# EAGLE design MotorDriver2016 (EAGLE 6.2)
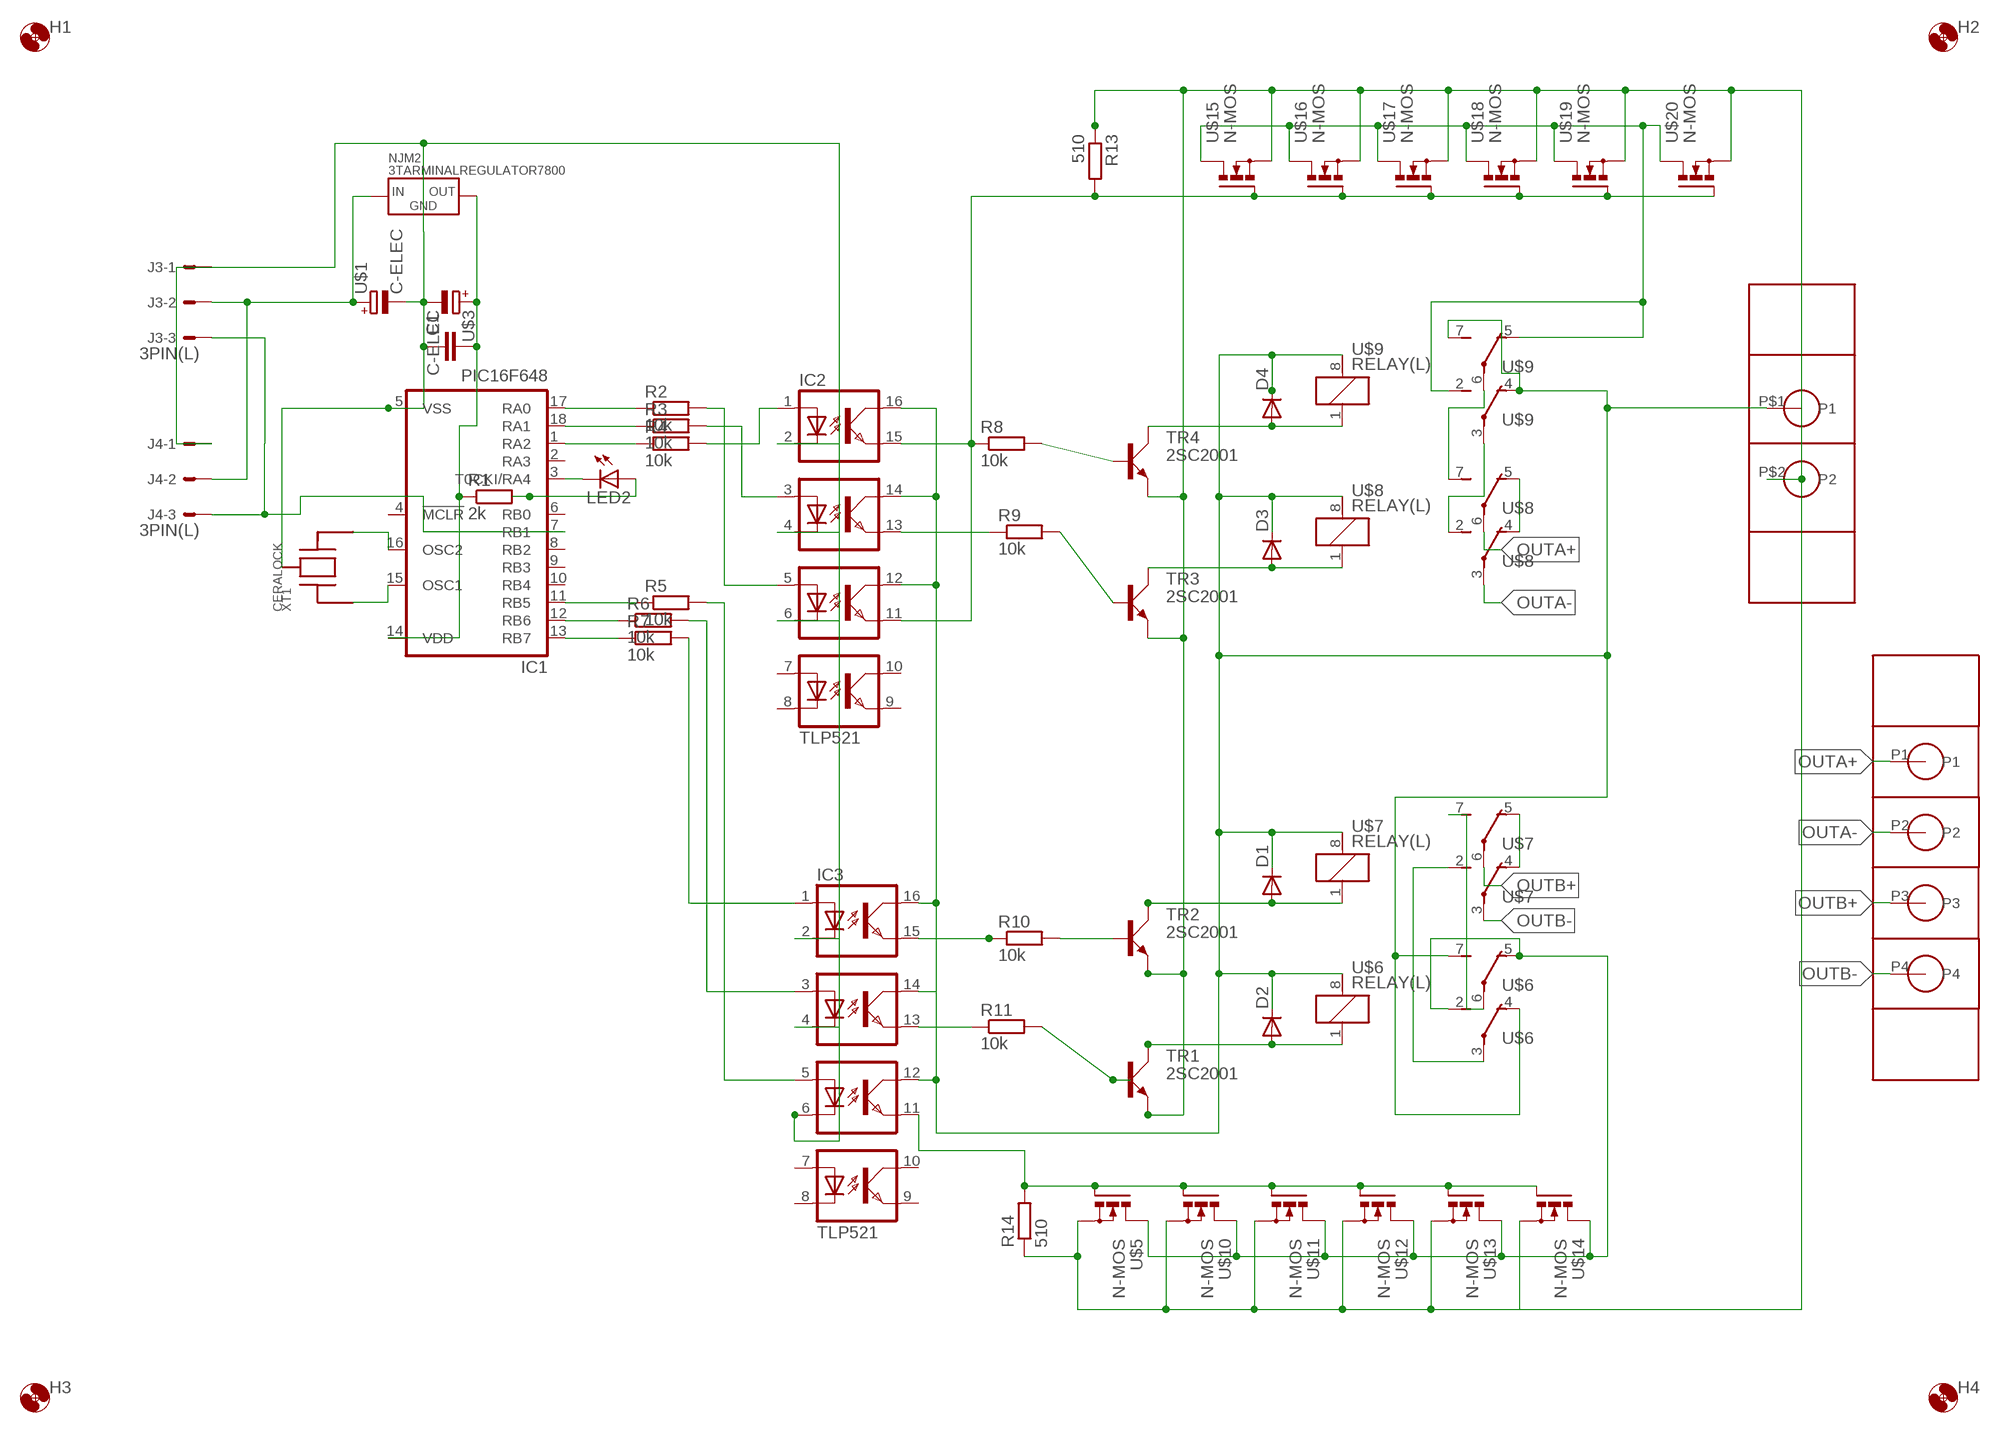
[diagram p0: schematic, sheet 1]

## Parts
C1  C-  [C-2.54]
D1  DIODE7.5  [DIODE7.5]
D2  DIODE7.5  [DIODE7.5]
D3  DIODE7.5  [DIODE7.5]
D4  DIODE7.5  [DIODE7.5]
H1  HOLE3.3M3BOLT  [HOLE3.3]
H2  HOLE3.3M3BOLT  [HOLE3.3]
H3  HOLE3.3M3BOLT  [HOLE3.3]
H4  HOLE3.3M3BOLT  [HOLE3.3]
IC1  PIC16F648  [DIL18]
IC2  TLP521  [DIL16]
IC3  TLP521  [DIL16]
J3  3PIN(L)  [3PL]
J4  3PIN(L)  [3PL]
LED2  LED5MM  [LED5MM]
NJM2  3TARMINALREGULATOR7800  [TO-220]
R1  2k  R-EU_R3216W  [R3216W]
R2  10k  R-EU_R3216W  [R3216W]
R3  10k  R-EU_R3216W  [R3216W]
R4  10k  R-EU_R3216W  [R3216W]
R5  10k  R-EU_R3216W  [R3216W]
R6  10k  R-EU_R3216W  [R3216W]
R7  10k  R-EU_R3216W  [R3216W]
R8  10k  R-EU_R3216W  [R3216W]
R9  10k  R-EU_R3216W  [R3216W]
R10  10k  R-EU_R3216W  [R3216W]
R11  10k  R-EU_R3216W  [R3216W]
R13  510  R-EU_R3216W  [R3216W]
R14  510  R-EU_R3216W  [R3216W]
TR1  2SC2001  [TO92BCE]
TR2  2SC2001  [TO92BCE]
TR3  2SC2001  [TO92BCE]
TR4  2SC2001  [TO92BCE]
U$1  C-ELEC  [C-6MM]
U$2  BP341L  [BP341L]
U$3  C-ELEC  [C-6MM]
U$4  BP341L_1  [BP341L]
U$5  N-MOS  [TO220BV]
U$6  RELAY(L)  [G2R2]
U$7  RELAY(L)  [G2R2]
U$8  RELAY(L)  [G2R2]
U$9  RELAY(L)  [G2R2]
U$10  N-MOS  [TO220BV]
U$11  N-MOS  [TO220BV]
U$12  N-MOS  [TO220BV]
U$13  N-MOS  [TO220BV]
U$14  N-MOS  [TO220BV]
U$15  N-MOS  [TO220BV]
U$16  N-MOS  [TO220BV]
U$17  N-MOS  [TO220BV]
U$18  N-MOS  [TO220BV]
U$19  N-MOS  [TO220BV]
U$20  N-MOS  [TO220BV]
XT1  CERALOCK  [CERALOCK]

## Nets
5V: C1.P$2 IC1.14(VDD) NJM2.OUT R1.1 U$3.+
9V: J3.2 J4.2 NJM2.IN U$1.+
12V: D1.PK(C) D2.PK(C) D3.PK(C) D4.PK(C) IC2.12(COL2) IC2.14(COL1) IC2.16(COL0) IC3.12(COL2) IC3.14(COL1) IC3.16(COL0) U$4.P$1(P1) U$6.4(R2:O) U$6.7(R1:S) U$6.8 U$7.8 U$8.8 U$9.4(R2:O) U$9.7(R1:S) U$9.8
FET_D1: U$9.2(R2:S) U$9.5(R1:O) U$15.D U$16.D U$17.D U$18.D U$19.D U$20.D
FET_G1: IC2.11(EMIT2) R13.2 U$15.G U$16.G U$17.G U$18.G U$19.G U$20.G
FET_G2: IC3.11(EMIT2) R14.2 U$5.G U$10.G U$11.G U$12.G U$13.G U$14.G
GND1: C1.P$1 IC1.5(VSS) IC2.2(C0) IC2.4(C1) IC2.6(C2) IC3.2(C0) IC3.4(C1) IC3.6(C2) J3.1 J4.1 NJM2.GND U$1.- U$3.- XT1.P2
GND2: R13.1 R14.1 TR1.E TR2.E TR3.E TR4.E U$4.P$2(P2) U$5.S U$10.S U$11.S U$12.S U$13.S U$14.S U$15.S U$16.S U$17.S U$18.S U$19.S U$20.S
LED_A: LED2.A R1.2
LED_C: IC1.3(T0CKI/RA4) LED2.K(C)
N$1: IC1.16(OSC2) XT1.P3
N$7: IC1.15(OSC1) XT1.P1
N$10: IC1.17(RA0) R2.1
N$11: IC1.18(RA1) R3.1
N$12: IC1.1(RA2) R4.1
N$13: IC1.13(RB7) R7.1
N$14: IC1.12(RB6) R6.1
N$15: IC1.11(RB5) R5.1
N$16: IC2.5(A2) R2.2
N$17: IC2.3(A1) R3.2
N$18: IC2.1(A0) R4.2
N$19: IC3.1(A0) R7.2
N$20: IC3.3(A1) R6.2
N$21: IC3.5(A2) R5.2
N$23: IC2.15(EMIT0) R8.1
N$24: IC2.13(EMIT1) R9.1
N$25: IC3.15(EMIT0) R10.1
N$26: IC3.13(EMIT1) R11.1
N$27: R11.2 TR1.B
N$29: D4.PA(A) TR4.C U$9.1
N$30: D3.PA(A) TR3.C U$8.1
N$31: D1.PA(A) TR2.C U$7.1
N$32: D2.PA(A) TR1.C U$6.1
N$37: U$5.D U$6.2(R2:S) U$6.5(R1:O) U$10.D U$11.D U$12.D U$13.D U$14.D
N$40: U$8.7(R1:S) U$9.6(R1:P)
N$41: U$8.2(R2:S) U$9.3(R2:P)
N$42: U$8.4(R2:O) U$8.5(R1:O)
N$43: R8.2 TR4.B
N$44: R9.2 TR3.B
N$45: R10.2 TR2.B
N$50: U$6.6(R1:P) U$7.7(R1:S)
N$51: U$6.3(R2:P) U$7.2(R2:S)
N$53: U$7.4(R2:O) U$7.5(R1:O)
OUTA+: U$2.P1 U$8.6(R1:P)
OUTA-: U$2.P2 U$8.3(R2:P)
OUTB+: U$2.P3 U$7.6(R1:P)
OUTB-: U$2.P4 U$7.3(R2:P)
SIGNAL: IC1.7(RB1) J3.3 J4.3
Unconnected: IC1.2(RA3) IC1.4(!MCLR) IC1.6(RB0) IC1.8(RB2) IC1.9(RB3) IC1.10(RB4) IC2.7(A3) IC2.8(C3) IC2.9(EMIT3) IC2.10(COL3) IC3.7(A3) IC3.8(C3) IC3.9(EMIT3) IC3.10(COL3)

## Library data of the parts
C1 = My_rcl:C-
D1-D4 = diode:DIODE7.5
H1-H4 = Hole:HOLE3.3
IC1 = FP-21T for MITS:PIC16F648
IC2 IC3 = FP-21T for MITS:TLP521
J3 J4 = my_connector:3PIN(L)
LED2 = FP-21T for MITS:LED: LED OSRAM: - CHIPLED LG R971, LG N971, LY N971, LG Q971, LY Q971, LO R971, LY R971 LH N974, LH R974 LS Q976, LO Q976, LY Q976 LO Q996 - Hyper CHIPLED LW Q18S LB Q993, LB Q99A, LB R99A - SideLED LS A670, LO A670, LY A670, LG A670, LP A670 LB A673, LV A673, LT A673, LW A673 LH A674 LY A675 LS A676, LA A676, LO A676, LY A676, LW A676 LS A679, LY A679, LG A679 - Hyper Micro SIDELED® LS Y876, LA Y876, LO Y876, LY Y876 LT Y87S - SmartLED LW L88C, LW L88S LB L89C, LB L89S, LG L890 LS L89K, LO L89K, LY L89K LS L896, LA L896, LO L896, LY L896 - TOPLED LS T670, LO T670, LY T670, LG T670, LP T670 LSG T670, LSP T670, LSY T670, LOP T670, LYG T670 LG T671, LOG T671, LSG T671 LB T673, LV T673, LT T673, LW T673 LH T674 LS T676, LA T676, LO T676, LY T676, LB T676, LH T676, LSB T676, LW T676 LB T67C, LV T67C, LT T67C, LS T67K, LO T67K, LY T67K, LW E67C LS E67B, LA E67B, LO E67B, LY E67B, LB E67C, LV E67C, LT E67C LW T67C LS T679, LY T679, LG T679 LS T770, LO T770, LY T770, LG T770, LP T770 LB T773, LV T773, LT T773, LW T773 LH T774 LS E675, LA E675, LY E675, LS T675 LS T776, LA T776, LO T776, LY T776, LB T776 LHGB T686 LT T68C, LB T68C - Hyper Mini TOPLED® LB M676 - Mini TOPLED Santana® LG M470 LS M47K, LO M47K, LY M47K Source: http://www.osram.convergy.de - LUMILED® LXK2-PW12-R00, LXK2-PW12-S00, LXK2-PW14-U00, LXK2-PW14-V00 LXK2-PM12-R00, LXK2-PM12-S00, LXK2-PM14-U00 LXK2-PE12-Q00, LXK2-PE12-R00, LXK2-PE12-S00, LXK2-PE14-T00, LXK2-PE14-U00 LXK2-PB12-K00, LXK2-PB12-L00, LXK2-PB12-M00, LXK2-PB14-N00, LXK2-PB14-P00, LXK2-PB14-Q00 LXK2-PR12-L00, LXK2-PR12-M00, LXK2-PR14-Q00, LXK2-PR14-R00 LXK2-PD12-Q00, LXK2-PD12-R00, LXK2-PD12-S00 LXK2-PH12-R00, LXK2-PH12-S00 LXK2-PL12-P00, LXK2-PL12-Q00, LXK2-PL12-R00 Source: www.luxeon.com
NJM2 = regulator:3TARMINALREGULATOR
R1-R11 R13 R14 = rcl:R-EU_: RESISTOR, European symbol
TR1-TR4 = My_transistor:2SC2001: NPN Transistor
U$1 U$3 = My_rcl:C-ELEC
U$2 = BP341_4PIN:BP341L
U$4 = BP341L_1:BP341L_1
U$5 U$10-U$20 = FET_kai:N-MOS
U$6-U$9 = relay:RELAY(L)
XT1 = ceralock:CERALOCK

## Board
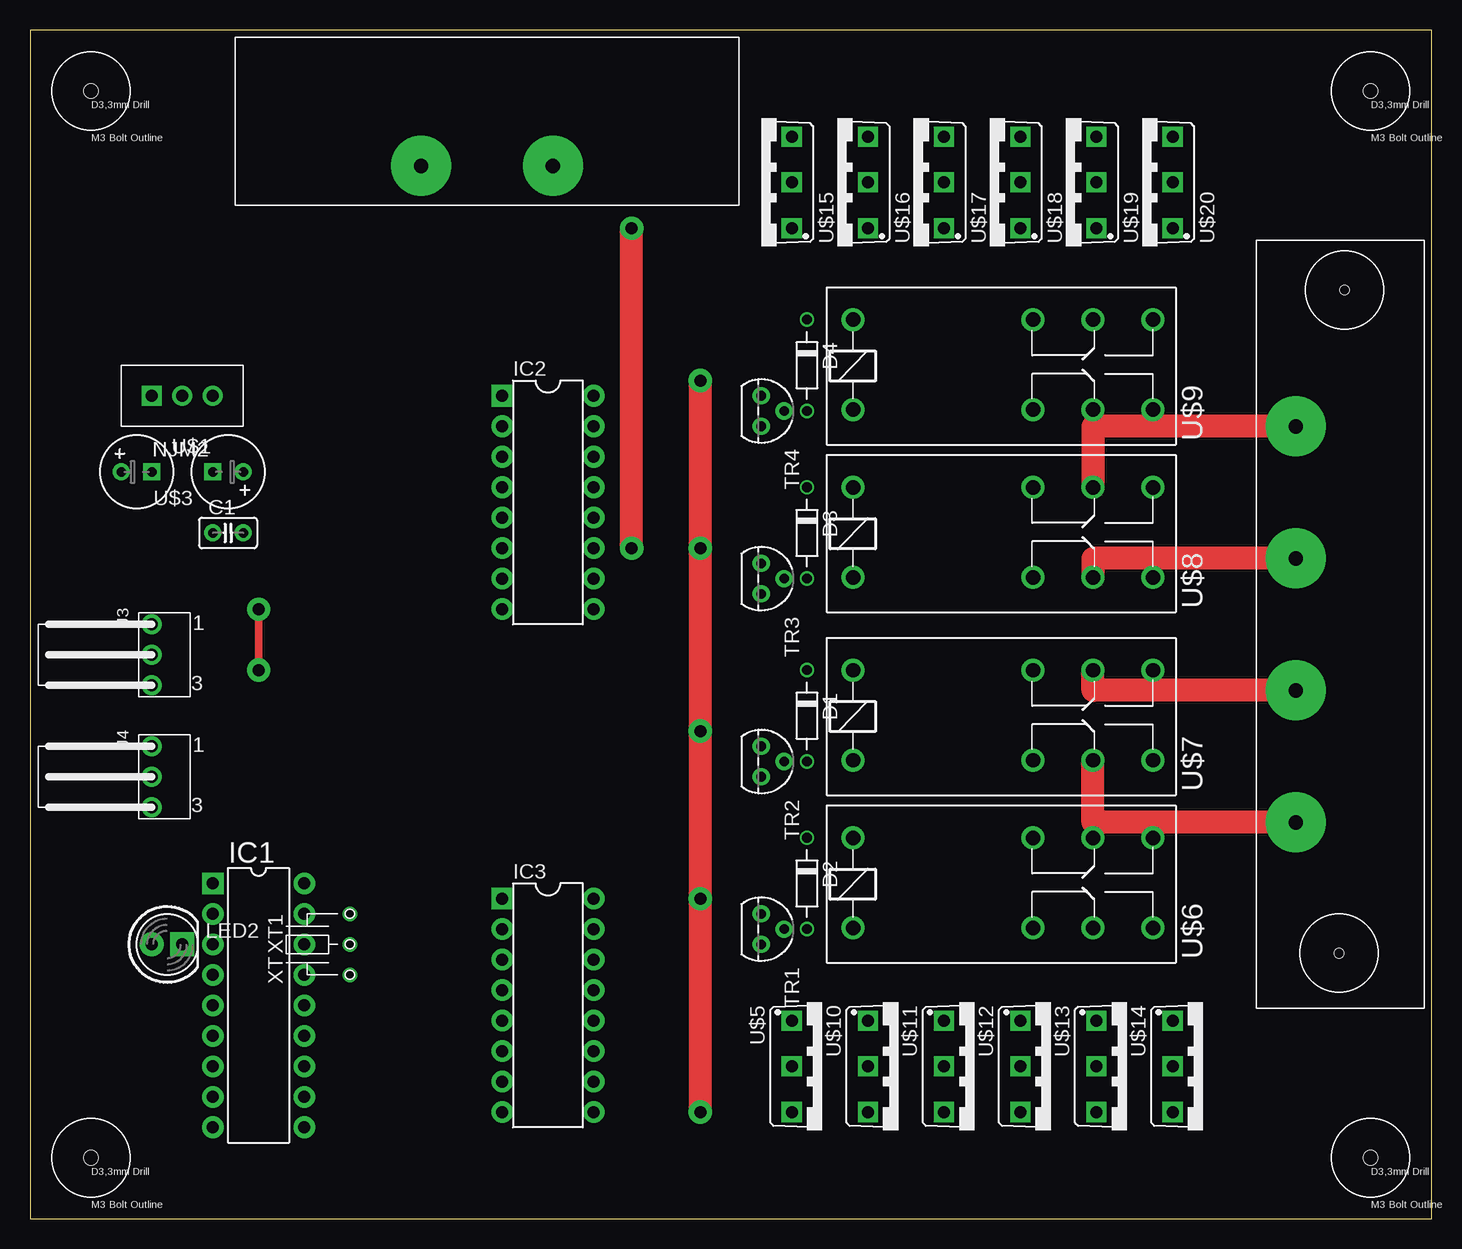
[diagram p1: board, top side]
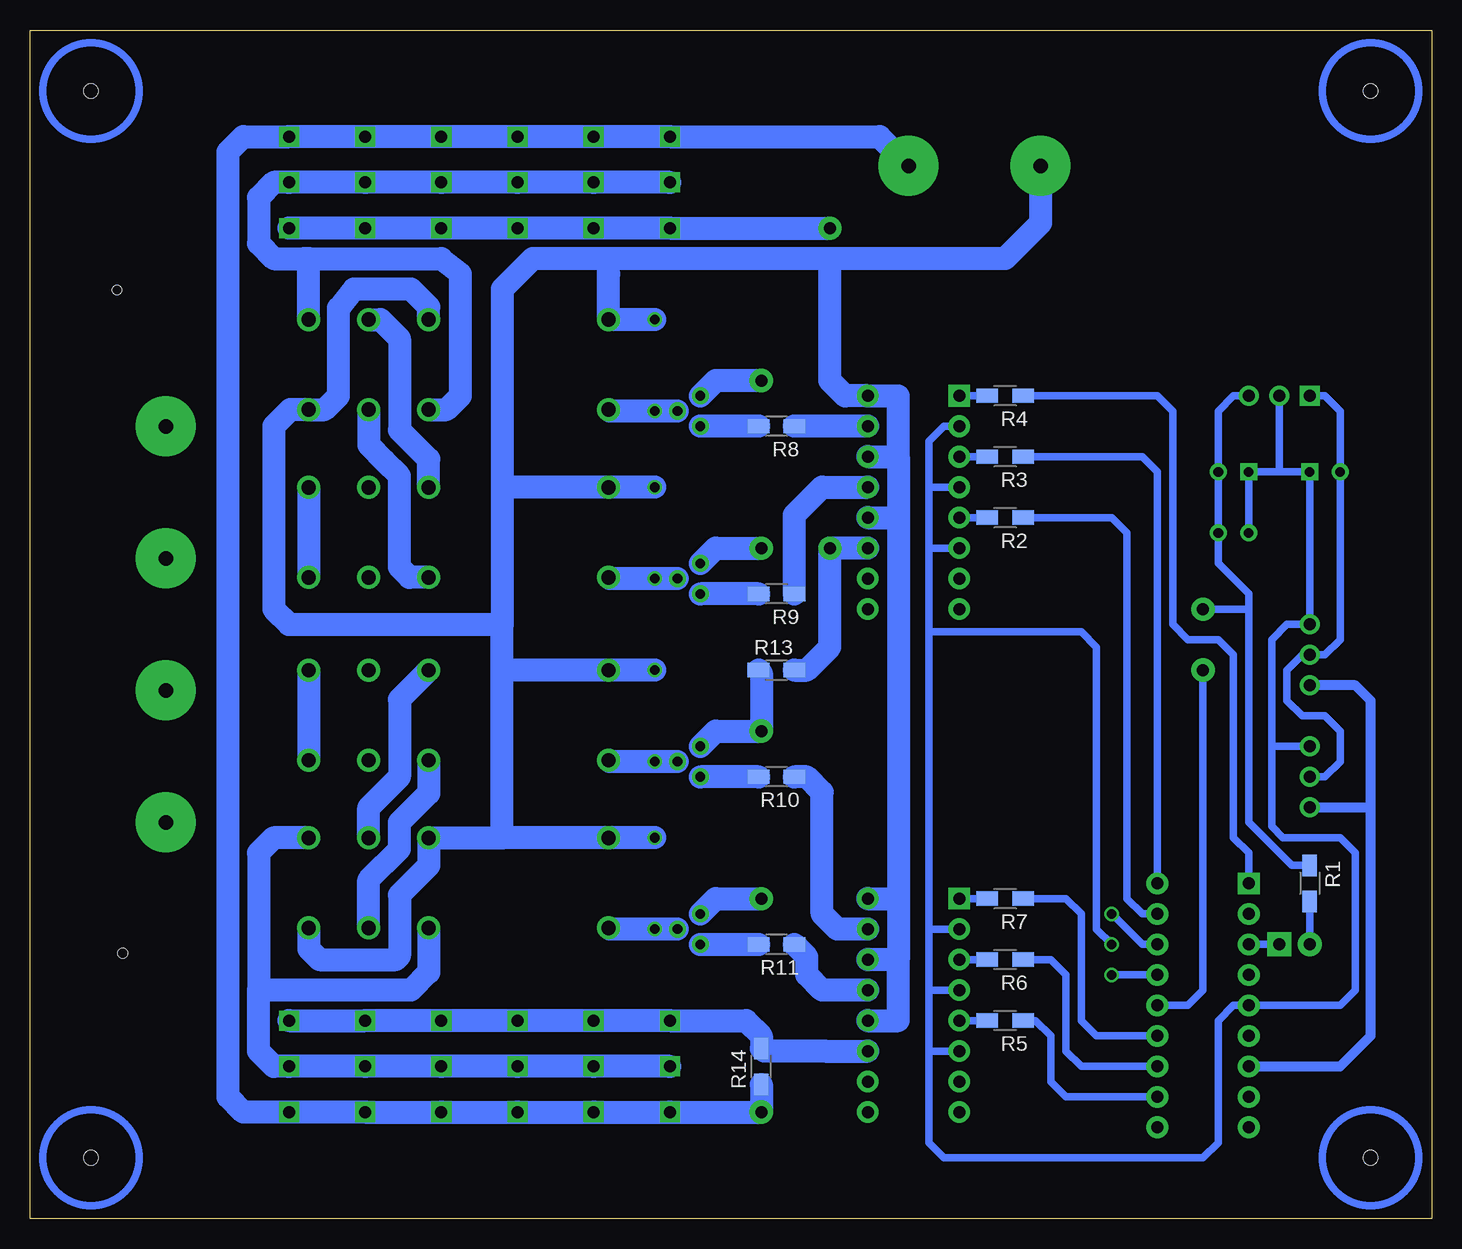
[diagram p2: board, bottom side, seen from below]

Size 116.84 x 99.06 mm. Coordinates in mm from the lower left corner, seen from the top.
Outline: 0,0 116.84,0 116.84,99.06 0,99.06 0,0
Copper layers (1*16): Top 0.035mm / dielectric 1.5mm / Bottom 0.035mm
Design rules: minimum track width 0.15mm, minimum drill 0.3mm, track to track 0.25mm, track to pad 0.25mm, pad to pad 0.25mm, via to via 0.25mm, smd to smd 0.2mm, copper to edge 100mil, drill to drill 0.45mm, minimum pad ring 0.15mm, minimum via ring 0.15mm, stop-mask expansion 4mil, vias tented up to drill 0mil, thermal gap 0.15mm

### Footprints (pad centres in the part's own frame; a part is rotated, then mirrored left to right if it is on the bottom)
C-2.54 = drill 0.8 pad 1.422: P$1 -1.27,0; P$2 1.27,0
DIODE7.5 = drill 0.8: PA 3.81,0; PK -3.81,0
HOLE3.3 = hole 1.2: 0,0
DIL18 = drill 1 pad 1.8 square: 1 -10.16,-3.81 | drill 1 pad 1.8: 2 -7.62,-3.81; 3 -5.08,-3.81; 4 -2.54,-3.81; 5 0,-3.81; 6 2.54,-3.81; 7 5.08,-3.81; 8 7.62,-3.81; 9 10.16,-3.81; 10 10.16,3.81; 11 7.62,3.81; 12 5.08,3.81; 13 2.54,3.81; 14 0,3.81; 15 -2.54,3.81; 16 -5.08,3.81; 17 -7.62,3.81; 18 -10.16,3.81
DIL16 = drill 1 pad 1.8 square: 1 -8.89,-3.81 | drill 1 pad 1.8: 2 -6.35,-3.81; 3 -3.81,-3.81; 4 -1.27,-3.81; 5 1.27,-3.81; 6 3.81,-3.81; 7 6.35,-3.81; 8 8.89,-3.81; 9 8.89,3.81; 10 6.35,3.81; 11 3.81,3.81; 12 1.27,3.81; 13 -1.27,3.81; 14 -3.81,3.81; 15 -6.35,3.81; 16 -8.89,3.81
3PL = drill 1 pad 1.676: 1 2.54,3.81; 2 0,3.81; 3 -2.54,3.81
LED5MM = drill 1 pad 2: A -1.27,0 | drill 1 pad 2 square: K 1.27,0
TO-220 = drill 1 pad 1.676: GND 0,0; OUT 2.54,0 | drill 1 pad 1.676 square: IN -2.54,0
R3216W = smd 1.8 x 1.2: 1 -1.499,0; 2 1.499,0
TO92BCE = drill 0.8 pad 1.422: B 1.27,0; C 0,1.905; E -1.27,0
C-6MM = drill 0.8 pad 1.422: + -1.27,0 | drill 0.8 pad 1.422 square: - 1.27,0
BP341L = drill 1.2 pad 5: P1 -16.5,-3.7; P2 -5.5,-3.7; P3 5.5,-3.7; P4 16.5,-3.7 | hole 0.8: -27.87,0.37; 27.4,-0.1
BP341L' = drill 1.2 pad 5: P$1 -5.499,-3.698; P$2 5.499,-3.698
TO220BV = drill 1 pad 1.676 square: D 0,0; G -3.81,0; S 3.81,0
G2R2 = drill 1.2 pad 1.93: 1 -11.4,-3.7; 2 3.6,-3.7; 3 8.6,-3.7; 4 13.6,-3.7; 5 13.6,3.8; 6 8.6,3.8; 7 3.6,3.8; 8 -11.4,3.8
CERALOCK = drill 0.8: P1 -2.54,-3.81; P2 0,-3.81; P3 2.54,-3.81

### Placement (x,y rotation side)
C1  16.51,57.15 0 top
D1  64.77,41.91 270 top
D2  64.77,27.94 270 top
D3  64.77,57.15 270 top
D4  64.77,71.12 270 top
H1  111.76,5.08 0 top
H2  5.08,93.98 0 top
H3  5.08,5.08 0 top
H4  111.76,93.98 0 top
IC1  19.05,17.78 270 top
IC2  43.18,59.69 270 top
IC3  43.18,17.78 270 top
J3  13.97,46.99 90 top
J4  13.97,36.83 90 top
LED2  11.43,22.86 0 top
NJM2  12.7,68.58 0 top
R1  10.16,27.94 270 bottom
R2  35.56,58.42 180 bottom
R3  35.56,63.5 180 bottom
R4  35.56,68.58 180 bottom
R5  35.56,16.51 180 bottom
R6  35.56,21.59 180 bottom
R7  35.56,26.67 180 bottom
R8  54.61,66.04 180 bottom
R9  54.61,52.07 180 bottom
R10  54.61,36.83 180 bottom
R11  54.61,22.86 180 bottom
R13  54.61,45.72 0 bottom
R14  55.88,12.7 90 bottom
TR1  60.96,24.13 270 top
TR2  60.96,38.1 270 top
TR3  60.96,53.34 270 top
TR4  60.96,67.31 270 top
U$1  8.89,62.23 0 top
U$2  109.22,49.53 270 top
U$3  16.51,62.23 180 top
U$4  BP341L_1  [BP341L']  38.1,91.44 0 top
U$5  63.5,12.7 270 top
U$6  80.01,27.94 0 top
U$7  80.01,41.91 0 top
U$8  80.01,57.15 0 top
U$9  80.01,71.12 0 top
U$10  69.85,12.7 270 top
U$11  76.2,12.7 270 top
U$12  82.55,12.7 270 top
U$13  88.9,12.7 270 top
U$14  95.25,12.7 270 top
U$15  63.5,86.36 90 top
U$16  69.85,86.36 90 top
U$17  76.2,86.36 90 top
U$18  82.55,86.36 90 top
U$19  88.9,86.36 90 top
U$20  95.25,86.36 90 top
XT1  22.86,22.86 90 top

### Tracks (layer width: path | path; a pad name or v marks a point on that pad's centre or on a via)
5V  (via drill 1 pad 1.93)
  Top 0.61: v19.05,45.72 v19.05,50.8
  Bottom 0.61: NJM2.OUT 16.51,68.58 17.78,67.31 U$3.+ C1.P$2 17.78,54.61 15.24,52.07 15.24,50.8 | R1.1 11.66,29.44 15.24,33.02 15.24,50.8 | IC1.14 20.32,17.78 19.05,19.05 v19.05,45.72 | v19.05,50.8 15.24,50.8
9V
  Bottom 0.61: J4.2 8.89,36.83 7.62,38.1 7.62,40.64 8.89,41.91 10.79,41.91 12.06,43.18 12.06,45.72 10.79,46.99 J3.2 8.89,46.99 7.62,48.26 U$1.+ 7.62,67.31 8.89,68.58 NJM2.IN
12V
  Bottom 1.93: U$9.7 83.61,75.99 85.09,77.47 89.85,77.47 91.12,75.88 91.12,68.58 92.28,67.42 U$9.4 95.14,67.42 96.52,66.04 96.52,50.8 95.25,49.53 77.47,49.53 | D2.PK U$6.8 77.47,31.74 | D1.PK U$7.8 | U$7.8 | D3.PK U$8.8 | U$8.8 | U$7.8 77.47,45.72 | 77.47,45.72 77.47,49.53 | U$8.8 77.47,60.95 | 77.47,60.95 77.47,49.53 | 77.47,60.95 77.47,74.92 77.47,77.47 74.93,80.01 68.58,80.01 | 77.47,31.74 77.47,45.72 | U$6.4 93.61,22.49 92.71,21.59 86.36,21.59 86.04,21.91 86.04,26.99 83.61,29.42 U$6.7 77.47,31.74 | IC3.16 44.45,26.67 | IC3.12 44.45,16.51 44.45,21.59 | 44.45,21.59 IC3.14 | 44.45,26.67 44.45,21.59 | 44.45,63.5 44.45,68.58 IC2.16 48.9,68.58 50.16,69.85 50.16,80.01 | IC2.12 44.45,58.42 | 44.45,58.42 44.45,26.67 | 44.45,63.5 44.45,58.42 | IC2.14 44.45,63.5 | U$4.P$1 32.6,82.97 35.56,80.01 50.16,80.01 | 50.16,80.01 68.58,80.01 | D4.PK U$9.8 68.61,78.71 68.58,80.01
FET_D1
  Bottom 1.93: U$15.D U$16.D U$17.D U$18.D U$19.D U$20.D 96.52,86.36 97.79,85.09 97.79,81.28 96.52,80.01 93.98,80.01 | 93.98,80.01 82.55,80.01 80.96,78.74 80.96,68.58 82.12,67.42 U$9.2 | U$9.5 93.61,80.01 93.98,80.01
FET_G1  (via drill 1 pad 1.93)
  Top 1.93: v50.16,55.88 v50.16,82.55
  Bottom 1.93: U$20.G U$19.G U$18.G U$17.G U$16.G U$15.G v50.16,82.55 | IC2.11 v50.16,55.88 50.16,47.62 52.07,45.72 R13.2
FET_G2
  Bottom 1.93: U$14.G U$13.G U$12.G U$11.G U$10.G U$5.G 57.15,16.51 55.88,15.24 R14.2 55.65,13.97 50.57,13.97 IC3.11
GND1
  Bottom 0.61: J4.1 12.06,39.37 13.34,39.37 | 12.7,62.23 U$1.- J3.1 12.06,49.53 13.34,48.26 13.34,40.64 13.34,39.37 | 12.7,62.23 U$3.- C1.P$1 | NJM2.GND 12.7,62.23 | 13.34,39.37 13.34,32.7 12.38,31.75 7.62,31.75 6.35,30.48 6.35,19.05 7.62,17.78 IC1.5 16.51,17.78 17.78,16.51 17.78,6.35 19.05,5.08 40.64,5.08 41.91,6.35 41.91,13.97 | IC2.2 40.64,66.04 41.91,64.77 41.91,60.96 | 41.91,60.96 41.91,55.88 | 41.91,55.88 41.91,48.9 | 41.91,48.9 41.91,24.13 | 41.91,24.13 41.91,19.05 | 41.91,19.05 41.91,13.97 | XT1.P2 27.94,24.13 27.94,47.62 29.21,48.9 41.91,48.9 | IC2.6 41.91,55.88 | IC2.4 41.91,60.96 | IC3.2 41.91,24.13 | IC3.4 41.91,19.05 | IC3.6 41.91,13.97
GND2  (via drill 1 pad 1.93)
  Top 1.93: v55.88,8.89 v55.88,26.67 v55.88,40.64 v55.88,55.88 v55.88,69.85
  Bottom 1.93: TR3.E 59.69,55.88 v55.88,55.88 | TR2.E 59.69,40.64 v55.88,40.64 55.88,45.49 R13.1 | TR1.E 59.69,26.67 v55.88,26.67 | R14.1 v55.88,8.89 U$5.S U$10.S U$11.S U$12.S U$13.S U$14.S 99.06,8.89 100.33,10.16 100.33,88.9 99.06,90.17 U$20.S U$19.S U$18.S U$17.S U$16.S U$15.S 46.03,90.17 U$4.P$2 | v55.88,69.85 59.69,69.85 TR4.E
LED_A
  Bottom 0.61: R1.2 LED2.A
LED_C
  Bottom 0.61: LED2.K IC1.3
N$1
  Bottom 0.61: IC1.16 24.13,22.86 XT1.P3
N$7
  Bottom 0.61: IC1.15 XT1.P1
N$10
  Bottom 0.61: IC1.17 24.13,25.4 25.4,26.67 25.4,57.15 26.67,58.42 R2.1
N$11
  Bottom 0.61: IC1.18 22.86,29.21 22.86,62.23 24.13,63.5 R3.1
N$12
  Bottom 0.61: IC1.1 15.24,30.48 16.51,31.75 16.51,46.99 17.78,48.26 20.32,48.26 21.59,49.53 21.59,67.31 22.86,68.58 R4.1
N$13
  Bottom 0.61: IC1.13 27.94,15.24 29.21,16.51 29.21,25.4 30.48,26.67 R7.1
N$14
  Bottom 0.61: IC1.12 29.21,12.7 30.48,13.97 30.48,20.32 31.75,21.59 R6.1
N$15
  Bottom 0.61: IC1.11 30.48,10.16 31.75,11.43 31.75,15.24 33.02,16.51 R5.1
N$16
  Bottom 0.61: R2.2 IC2.5
N$17
  Bottom 0.61: R3.2 IC2.3
N$18
  Bottom 0.61: R4.2 IC2.1
N$19
  Bottom 0.61: R7.2 IC3.1
N$20
  Bottom 0.61: R6.2 IC3.3
N$21
  Bottom 0.61: R5.2 IC3.5
N$23
  Bottom 1.93: IC2.15 R8.1
N$24
  Bottom 1.93: R9.1 53.11,58.65 50.8,60.96 IC2.13
N$25
  Bottom 1.93: IC3.15 49.53,24.13 50.8,25.4 50.8,35.56 52.07,36.83 R10.1
N$26
  Bottom 1.93: IC3.13 50.8,19.05 52.07,20.32 52.07,21.82 R11.1
N$27
  Bottom 1.93: TR1.B R11.2
N$29
  Bottom 1.93: TR4.C D4.PA 68.5,67.31 U$9.1
N$30
  Bottom 1.93: TR3.C D3.PA 68.5,53.34 U$8.1
N$31
  Bottom 1.93: TR2.C D1.PA 68.5,38.1 U$7.1
N$32
  Bottom 1.93: TR1.C D2.PA 68.5,24.13 U$6.1
N$37
  Bottom 1.93: U$5.D U$10.D U$11.D U$12.D U$13.D U$14.D 96.52,12.7 97.79,13.97 97.79,19.05 | U$6.2 83.61,20.53 85.09,19.05 97.79,19.05 | U$6.5 96.53,31.74 97.79,30.48 97.79,19.05
N$40
  Bottom 1.93: U$8.7 83.61,63.29 86.04,65.72 86.04,73.34 87.62,74.92 U$9.6
N$41
  Bottom 1.93: U$8.2 85.2,53.45 86.04,54.29 86.04,61.91 87.31,63.18 88.61,64.48 U$9.3
N$42
  Bottom 1.93: U$8.5 U$8.4
N$43
  Bottom 1.93: R8.2 TR4.B
N$44
  Bottom 1.93: R9.2 TR3.B
N$45
  Bottom 1.93: R10.2 TR2.B
N$50
  Bottom 1.93: U$7.7 86.04,43.28 86.04,36.83 88.61,34.26 U$6.6
N$51
  Bottom 1.93: U$7.2 83.61,35.45 86.04,33.02 86.04,30.8 88.61,28.23 U$6.3
N$53
  Bottom 1.93: U$7.5 U$7.4
OUTA+
  Top 1.93: U$2.P1 88.61,66.03 U$8.6
OUTA-
  Top 1.93: U$2.P2 88.61,55.03 U$8.3
OUTB+
  Top 1.93: U$2.P3 88.61,44.03 U$7.6
OUTB-
  Top 1.93: U$2.P4 88.61,33.03 U$7.3
SIGNAL
  Bottom 0.813: IC1.7 7.62,12.7 5.08,15.24 5.08,34.29 | 5.08,34.29 5.08,43.18 6.35,44.45 J3.3 | J4.3 5.08,34.29